# Altium project FMC_DAC_125M_14B_16CHA.PrjPCB (part 2 of 2)

## Sheet Clock_circuit.SchDoc: Shuttler
size 420 x 297 mm; Author: G.Kasprowicz; CompanyName: WUT ISE; DrawnBy: G.Kasprowicz; Organization: WUT ISE; Address1: PW ISE; Address2: Nowowiejska 15/19 00-665 Warsaw; Address3: gkasprow@gmail.com; DocumentNumber: 3; Revision: 1.2; SheetNumber: 3; SheetTotal: 10; ModifiedBy: -; CheckedDate: -; Title2: Clock distribution; DivGrp: WUT ISE; Designer: G.Kasprowicz; ModifiedDate: -; ProjectName: Sensor Box
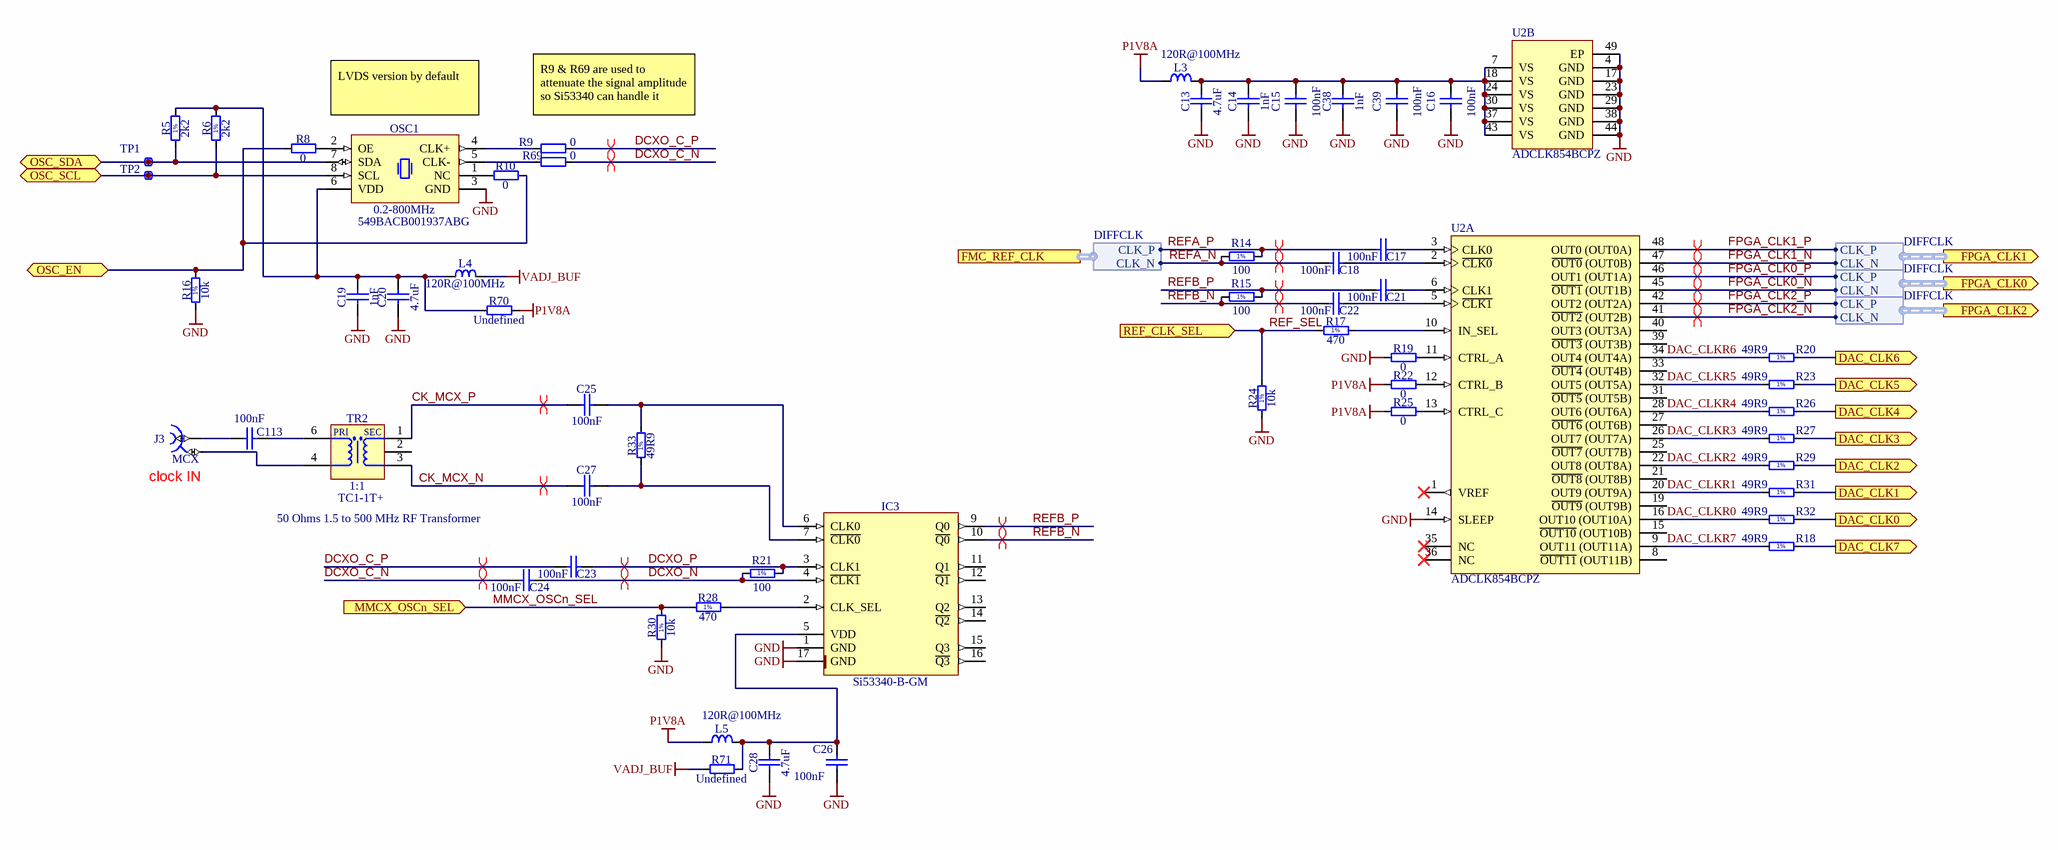
[diagram p3: Clock_circuit.SchDoc]

### Parts
C13  4.7uF  [CAPC2012X135N]
C14  1nF  [CAPC1005X55N]
C15  100nF  [CAPC1005X55N]
C16  100nF  [CAPC1005X55N]
C17  100nF  [CAPC1005X55N]
C18  100nF  [CAPC1005X55N]
C19  1nF  [CAPC1005X55N]
C20  4.7uF  [CAPC2012X135N]
C21  100nF  [CAPC1005X55N]
C22  100nF  [CAPC1005X55N]
C23  100nF  [CAPC1005X55N]
C24  100nF  [CAPC1005X55N]
C25  100nF  [CAPC1005X55N]
C26  100nF  [CAPC1005X55N]
C27  100nF  [CAPC1005X55N]
C28  4.7uF  [CAPC2012X135N]
C38  1nF  [CAPC1005X55N]
C39  100nF  [CAPC1005X55N]
C113  100nF  [CAPC0603X33N]
IC3  Si53340-B-GM  [QFN50P300X300X90-17N-S175]
J3  MCX  [AMPHENOL_919-383J-51A]
L3  120R@100MHz  [INDC1608X95N]
L4  120R@100MHz  [INDC1608X65N]
L5  120R@100MHz  [INDC1608X95N]
OSC1  0.2-800MHz  Manufacturer Part Number: 549BACB001937ABG  [OSC_SILICON-LAB_SI549-A]
R5  2k2  [RESC1005X40N]
R6  2k2  [RESC1005X40N]
R8  0  [RESC1005X40N]
R9  0  [RESC1005X40N]
R10  0  [RESC1005X40N]
R14  100  [RESC0603X28N]
R15  100  [RESC0603X28N]
R16  10k  [RESC1005X40N]
R17  470  [RESC1005X40N]
R18  49R9  [RESC1005X40N]
R19  0  [RESC1005X40N]
R20  49R9  [RESC1005X40N]
R21  100  [RESC0603X28N]
R22  0  [RESC1005X40N]
R23  49R9  [RESC1005X40N]
R24  10k  [RESC1005X40N]
R25  0  [RESC1005X40N]
R26  49R9  [RESC1005X40N]
R27  49R9  [RESC1005X40N]
R28  470  [RESC1005X40N]
R29  49R9  [RESC1005X40N]
R30  10k  [RESC1005X40N]
R31  49R9  [RESC1005X40N]
R32  49R9  [RESC1005X40N]
R33  49R9  [RESC1005X40N]
R69  0  [RESC1005X40N]
R70  Undefined  [RESC1608X55N]
R71  Undefined  [RESC1608X55N]
TP1  I2C SW SDA  [TPS127]  (value not drawn)  (no BOM)
TP2  I2C SW SCL  [TPS127]  (value not drawn)  (no BOM)
TR2  1:1  Part Description: 50 Ohms 1.5 to 500 MHz RF Transformer  Manufacturer Part Number: TC1-1T+  [XFMR_MINI-CIRCUITS_AT224-1]
U2  ADCLK854BCPZ  [ADI-CP-48-6_L]  (parts A,B of 2)

### Ports
DAC_CLK0 (out), DAC_CLK1 (out), DAC_CLK2 (out), DAC_CLK3 (out), DAC_CLK4 (out), DAC_CLK5 (out), DAC_CLK6 (out), DAC_CLK7 (out), FMC_REF_CLK (harness DIFFCLK), FPGA_CLK0 (out, harness DIFFCLK), FPGA_CLK1 (out, harness DIFFCLK), FPGA_CLK2 (out, harness DIFFCLK), MMCX_OSCn_SEL (in), OSC_EN (bidir), OSC_SCL (bidir), OSC_SDA (bidir), REF_CLK_SEL (in)

### Harnesses
DIFFCLK: CLK_P, CLK_N

### Nets
GND: C13.1 C14.1 C15.1 C16.1 C19.1 C20.1 C26.1 C28.1 C38.1 C39.1 IC3.1(GND) IC3.17(GND) OSC1.3(GND) R16.1 R19.1 R24.1 R30.1 U2.4(GND) U2.14(SLEEP) U2.17(GND) U2.23(GND) U2.29(GND) U2.38(GND) U2.44(GND) U2.49(EP)
P1V8A: L3.2 L5.2 R22.1 R25.1 R70.2
VADJ_BUF: L4.1 R71.1
CK_MCX_N: C27.1 TR2.3(S)
CK_MCX_P: C25.1 TR2.1(SDOT)
DAC_CLK0: R32.2 ; port DAC_CLK0
DAC_CLK1: R31.2 ; port DAC_CLK1
DAC_CLK2: R29.2 ; port DAC_CLK2
DAC_CLK3: R27.2 ; port DAC_CLK3
DAC_CLK4: R26.2 ; port DAC_CLK4
DAC_CLK5: R23.2 ; port DAC_CLK5
DAC_CLK6: R20.2 ; port DAC_CLK6
DAC_CLK7: R18.2 ; port DAC_CLK7
DAC_CLKR0: R32.1 U2.16(OUT10_(OUT10A))
DAC_CLKR1: R31.1 U2.20(OUT9_(OUT9A))
DAC_CLKR2: R29.1 U2.22(OUT8_(OUT8A))
DAC_CLKR3: R27.1 U2.26(OUT7_(OUT7A))
DAC_CLKR4: R26.1 U2.28(OUT6_(OUT6A))
DAC_CLKR5: R23.1 U2.32(OUT5_(OUT5A))
DAC_CLKR6: R20.1 U2.34(OUT4_(OUT4A))
DAC_CLKR7: R18.1 U2.9(OUT11_(OUT11A))
DCXO_C_N: C24.1 R69.2
DCXO_C_P: C23.1 R9.2
DCXO_N: C24.2 IC3.4(~{CLK1}) R21.1
DCXO_P: C23.2 IC3.3(CLK1) R21.2
FPGA_CLK0_N: U2.45(~{OUT1}_(OUT1B)) ; port FPGA_CLK0.CLK_N
FPGA_CLK0_P: U2.46(OUT1_(OUT1A)) ; port FPGA_CLK0.CLK_P
FPGA_CLK1_N: U2.47(~{OUT0}_(OUT0B)) ; port FPGA_CLK1.CLK_N
FPGA_CLK1_P: U2.48(OUT0_(OUT0A)) ; port FPGA_CLK1.CLK_P
FPGA_CLK2_N: U2.41(~{OUT2}_(OUT2B)) ; port FPGA_CLK2.CLK_N
FPGA_CLK2_P: U2.42(OUT2_(OUT2A)) ; port FPGA_CLK2.CLK_P
MMCX_OSCn_SEL: R28.1 R30.2 ; port MMCX_OSCn_SEL
REF_SEL: R17.1 R24.2 ; port REF_CLK_SEL
REFA_N: C18.1 R14.1 ; port FMC_REF_CLK.CLK_N
REFA_P: C17.1 R14.2 ; port FMC_REF_CLK.CLK_P
REFB_N: C22.1 IC3.10(~{Q0}) R15.1
REFB_P: C21.1 IC3.9(Q0) R15.2
NetC13_2: C13.2 C14.2 C15.2 C16.2 C38.2 C39.2 L3.1 U2.7(VS) U2.18(VS) U2.24(VS) U2.30(VS) U2.37(VS) U2.43(VS)
NetC17_2: C17.2 U2.3(CLK0)
NetC18_2: C18.2 U2.2(~{CLK0})
NetC19_2: C19.2 C20.2 L4.2 OSC1.6(VDD) R5.2 R6.2 R70.1
NetC21_2: C21.2 U2.6(CLK1)
NetC22_2: C22.2 U2.5(~{CLK1})
NetC25_2: C25.2 IC3.6(CLK0) R33.2
NetC26_2: C26.2 C28.2 IC3.5(VDD) L5.1 R71.2
NetC27_2: C27.2 IC3.7(~{CLK0}) R33.1
NetC113_1: C113.1 TR2.6(PDOT)
NetC113_2: C113.2 J3.1
NetIC3_2: IC3.2(CLK_SEL) R28.2
NetJ3_2: J3.2 TR2.4(P)
NetOSC1_1: OSC1.1(NC) R10.1
NetOSC1_2: OSC1.2(OE) R8.2
NetOSC1_4: OSC1.4(CLK+) R9.1
NetOSC1_5: OSC1.5(CLK-) R69.1
NetOSC1_7: OSC1.7(SDA) R5.1 TP1.1 ; port OSC_SDA
NetOSC1_8: OSC1.8(SCL) R6.1 TP2.1 ; port OSC_SCL
NetR8_1: R8.1 R10.2 R16.2 ; port OSC_EN
NetR17_2: R17.2 U2.10(IN_SEL)
NetR19_2: R19.2 U2.11(CTRL_A)
NetR22_2: R22.2 U2.12(CTRL_B)
NetR25_2: R25.2 U2.13(CTRL_C)

Not connected (* = marked no-connect by the designer): IC3 11(Q1) 12(~{Q1}) 13(Q2) 14(~{Q2}) 15(Q3) 16(~{Q3}); TR2 2(NU); U2 1(VREF)* 8(~{OUT11}_(OUT11B)) 15(~{OUT10}_(OUT10B)) 19(~{OUT9}_(OUT9B)) 21(~{OUT8}_(OUT8B)) 25(~{OUT7}_(OUT7B)) 27(~{OUT6}_(OUT6B)) 31(~{OUT5}_(OUT5B)) 33(~{OUT4}_(OUT4B)) 35(NC)* 36(NC)* 39(~{OUT3}_(OUT3B)) 40(OUT3_(OUT3A))

### Layout directives
differential pair: CK_MCX_N, CK_MCX_P, DCXO_C_N, DCXO_C_P, DCXO_N, DCXO_P, FPGA_CLK0_N, FPGA_CLK0_P, FPGA_CLK1_N, FPGA_CLK1_P, FPGA_CLK2_N, FPGA_CLK2_P, REFA_N, REFA_P, REFB_N, REFB_P
differential pair; differential pair class Diff_100Ohm: DCXO_C_N, DCXO_C_P

### Notes on the sheet
- LVDS version by default
- R9 & R69 are used to attenuate the signal amplitude so Si53340 can handle it
- (near J3) clock IN
- Project/Equipment
- Document
- Designer
- Drawn by
- Check.by
- Copyright WUT ISE 2018.
  This documentation describes Open Hardware and is licensed under the CERN OHL v.1.1. You may redistribute and modify this documentation under the terms of the CERN OHL v.1.1. (http://ohwr.org/CERNOHL). This documentation is distributed WITHOUT ANY EXPRESS OR IMPLIED WARRANTY, INCLUDING OF MERCHANTABILITY, SATISFACTORY QUALITY AND FITNESS FOR A PARTICULAR PURPOSE. Please see the CERN OHL v.1.1 for applicable conditions.
- Contact
- File
- Last Mod.
- Print Date
- Sheet
- Size
- A3
- of
- Rev
- (in symbol R0201_100R_1%_0.05W_200PPM) 1%
- (in symbol R0402_2K2_1%_0.0625W_100PPM) 1%
- (in symbol R0402_10K_1%_0.0625W_100PPM) 1%
- (in symbol R0402_49R9_1%_0.0625W_100PPM) 1%
- (in symbol R0402_470R_1%_0.0625W_100PPM) 1%
- (in symbol XFMR_MINI-CIRCUITS_TC1-1+) PRI; SEC

### Library data of the parts
C13 C20 C28 = CC0805_4.7UF_10V_10%_X5R: Non-polarised capacitor; Part Description: SMD Multilayer Chip Ceramic Capacitor; Manufacturer: GENERIC; Manufacturer1 Part Number: 222224013672; Voltage: 10V; TC: X5R; Tolerance: ±10%; Part Number: CC0805_4.7UF_10V_10%_X5R; Component Kind: Standard; Component Type: Standard; Pin Count: 2; Value: 4.7uF; Status: Preferred; Manufacturer Part Number: CC0805_4.7UF_10V_10%_X5R; Case: 0805; Mounted: Yes; Socket: No; SMD: Yes; Sense: No; Manufacturer1 Example: PHYCOMP; Manufacturer1 ComponentHeight: 1.45mm; HelpURL: \\cern.ch\dfs\Applications\Altium\Datasheets\CC0805_X5R_PHYCOMP_HC.pdf; Author: CERN DEM JLC; CreateDate: 03.12.2007; LatestRevisionDate: 03.12.2007
C14 C19 C38 = CC0402_1NF_50V_10%_X7R: Non-polarised capacitor; Part Description: SMD Multilayer Chip Ceramic Capacitor; Manufacturer: GENERIC; Manufacturer1 Part Number: 223858715623; Voltage: 50V; TC: X7R; Tolerance: ±10%; Part Number: CC0402_1NF_50V_10%_X7R; Component Kind: Standard; Component Type: Standard; Pin Count: 2; Value: 1nF; Status: Not Recommended; Manufacturer Part Number: CC0402_1NF_50V_10%_X7R; Case: 0402; Mounted: Yes; Socket: No; SMD: Yes; Sense: No; Manufacturer1 Example: PHYCOMP; Manufacturer1 ComponentHeight: 0.55mm; HelpURL: \\cern.ch\dfs\Applications\Altium\Datasheets\CC0402_X7R_PHYCOMP.pdf; Author: CERN DEM JLC; CreateDate: 03.12.2007; LatestRevisionDate: 03.12.2007
C15-C18 C21-C27 C39 = CC0402_100NF_16V_10%_X5R: Non-polarised capacitor; Part Description: SMD Multilayer Chip Ceramic Capacitor; Manufacturer: GENERIC; Manufacturer1 Part Number: GRM155R61C104KA88D; Voltage: 16V; TC: X5R; Tolerance: ±10%; Part Number: CC0402_100NF_16V_10%_X5R; Component Kind: Standard; Component Type: Standard; Pin Count: 2; Value: 100nF; Status: None; Manufacturer Part Number: CC0402_100NF_16V_10%_X5R; Case: 0402; Mounted: Yes; Socket: No; SMD: Yes; Sense: No; Manufacturer1 Example: MURATA; Manufacturer1 ComponentHeight: 0.55mm; HelpURL: \\cern.ch\dfs\Applications\Altium\Datasheets\CC0402_X5R_MURATA_GRM.pdf; Author: CERN DEM JLC; CreateDate: 10.12.2013; LatestRevisionDate: 10.12.2013
C113 = CC0201_100NF_6.3V_10%_X5R: Non-polarised capacitor; Part Description: SMD Multilayer Chip Ceramic Capacitor; Manufacturer: GENERIC; Manufacturer1 Part Number: 02016D104KAT2A; Voltage: 6.3V; TC: X5R; Tolerance: ±10%; Table: Capacitors SMD; Part Number: CC0201_100NF_6.3V_10%_X5R; Component Kind: Standard; Component Type: Standard; Pin Count: 2; Value: 100nF; Status: Not Recommended; Manufacturer Part Number: CC0201_100NF_6.3V_10%_X5R; Case: 0201; Mounted: Yes; Socket: No; SMD: Yes; Manufacturer1 Example: AVX; Manufacturer1 ComponentHeight: 0.33mm; HelpURL: \\cern.ch\dfs\Applications\Altium\Datasheets\CC0201_X5R_AVX.pdf; Author: CERN DEM JLC; CreateDate: 2007-12-03; LatestRevisionDate: 2007-12-03
IC3 = Si53340-B-GM: Low-Jitter LVDS Fanout Clock Buffers, 10-Output,  Any-Input, Any-Frequency up to 1250MHz; Manufacturer: SILICON LABS; PressFit: No; Bonding: No; Part Number: Si53340-B-GM; Component Kind: Standard; Component Type: Standard; Device: Si53340-B-GM; PackageDescription: QFN, 0.50mm Pitch, Square; 16 Pin, 3.00mm L X 3.00mm W X 0.90mm H Body (w/thermal tab 1.75mm x 1.75mm), IPC Medium Density; Part Description: Low-Jitter LVDS Fanout Clock Buffers, 10-Output,  Any-Input, Any-Frequency up to 1250MHz; Manufacturer Part Number: Si53340-B-GM; Pin Count: 17; Case: QFN16; Mounted: Yes; Socket: No; SMD: Yes; Sense: No; ComponentHeight: 0.9mm; HelpURL: \\cern.ch\dfs\Applications\Altium\Datasheets\Si53340-B-GM.pdf; Author: CERN DEM MR; CreateDate: 04.09.2017; LatestRevisionDate: 04.09.2017
J3 = AMPHENOL_919-383J-51A: Part Description: 50 Ohm, RF Connector, MCX Right Angle PCB Receptacle Jack; PressFit: No; Part Number: AMPHENOL_919-383J-51A; Component Kind: Standard; Component Type: Standard; Pin Count: 5; Family: MCX; Mounted: Yes; Socket: No; SMD: No; Sense: No; Status: None; Manufacturer: AMPHENOL; Manufacturer Part Number: 919-383J-51A; ComponentHeight: 6mm; HelpURL: \\cern.ch\dfs\Applications\Altium\Datasheets\AMPHENOL_919-383J-51A.pdf; Author: CERN DEM BC; CreateDate: 31/01/2019; LatestRevisionDate: 31/01/2019
L3 L5 = IND0603_MURATA_BLM18PG121SN1D: Inductor; Part Description: SMD EMIFIL Chip Ferrite Bead; Manufacturer: MURATA; Power: 2A; Resistance: 0.05R; Part Number: IND0603_MURATA_BLM18PG121SN1D; Component Kind: Standard; Component Type: Standard; Pin Count: 2; Value: 120R@100MHz; Status: None; Manufacturer Part Number: BLM18PG121SN1D; Case: 0603; Mounted: Yes; Socket: No; SMD: Yes; Sense: No; ComponentHeight: 0.95mm; HelpURL: \\cern.ch\dfs\Applications\Altium\Datasheets\IND0603_MURATA_BLM18P.pdf; Author: CERN DEM BC; CreateDate: 2015-07-27; LatestRevisionDate: 2015-07-27
L4 = IND0603_MURATA_BLM18SG121TN1D: Inductor; Part Description: SMD EMIFIL Suppression Chip Ferrite Bead; Manufacturer: MURATA; Power: 3A; Resistance: 0.025R; Tolerance: ±25%; Part Number: IND0603_MURATA_BLM18SG121TN1D; Component Kind: Standard; Component Type: Standard; Pin Count: 2; Value: 120R@100MHz; Status: None; Manufacturer Part Number: BLM18SG121TN1D; Case: 0603; Mounted: Yes; Socket: No; SMD: Yes; Sense: No; ComponentHeight: 0.65mm; HelpURL: \\cern.ch\dfs\Applications\Altium\Datasheets\IND0603_MURATA_BLM18S.pdf; Author: CERN DEM JLC; CreateDate: 23.07.2014; LatestRevisionDate: 23.07.2014
OSC1 = OSC_0.2-800MHZ_SILICON-LAB_549BACB001937ABG: Ultra Low Jitter I2C Programmable Crystal Oscillator (XO), Si549 Series; Part Description: 0.2-800MHz, 1.8V/2.5V/3.3V ±20ppm LVDS, Ultra Low Jitter I2C Programmable Crystal Oscillator (XO), Si549 Series; Manufacturer: SILICON LABS; PressFit: No; Bonding: No; Part Number: OSC_0.2-800MHZ_SILICON-LAB_549BACB001937ABG; Component Kind: Standard; Component Type: Standard; PackageDescription: Oscillator Si549 Series, 8 pins, 5x7mm; Value: 0.2-800MHz; Pin Count: 8; Mounted: Yes; Socket: No; SMD: Yes; Sense: No; ComponentHeight: 1.33mm; HelpURL: \\cern.ch\dfs\Applications\Altium\Datasheets\OSC_SILICON-LAB_SI549.pdf; Author: CERN DEM JMW; CreateDate: 27/11/2019; LatestRevisionDate: 02/12/2019
R5 R6 = R0402_2K2_1%_0.0625W_100PPM: Resistor - 1%; Part Description: General Purpose Thick Film Chip Resistor; Manufacturer: GENERIC; Manufacturer1 Part Number: 232270672202L; TC: ±100ppm/°C; PressFit: No; Part Number: R0402_2K2_1%_0.0625W_100PPM; Component Kind: Standard; Component Type: Standard; Pin Count: 2; Value: 2k2; Status: Not Recommended; Power: 0.0625W; Tolerance: ±1%; Manufacturer Part Number: R0402_2K2_1%_0.0625W_100PPM; Case: 0402; Mounted: Yes; Sense: No; Socket: No; SMD: Yes; Manufacturer1 Example: YAGEO PHYCOMP; Manufacturer1 ComponentHeight: 0.4mm; HelpURL: \\cern.ch\dfs\Applications\Altium\Datasheets\R0402_Phycomp_RC0402.pdf; Author: CERN DEM JLC; CreateDate: 03.12.2007; LatestRevisionDate: 17.10.2012
R8-R10 R19 R22 R25 R69 = R0402_0R_JUMPER: Resistor; Part Description: 1A (0.05R Max DC Resistance) Zero Ohm Jumper; Manufacturer: GENERIC; Manufacturer1 Part Number: 232270591001L; PressFit: No; Part Number: R0402_0R_JUMPER; Component Kind: Standard; Component Type: Standard; Pin Count: 2; Value: 0; Status: Not Recommended; Manufacturer Part Number: R0402_0R_JUMPER; Case: 0402; Mounted: Yes; Sense: No; Socket: No; SMD: Yes; Manufacturer1 Example: YAGEO PHYCOMP; Manufacturer1 ComponentHeight: 0.4mm; HelpURL: \\cern.ch\dfs\Applications\Altium\Datasheets\R0402_Phycomp_RC0402.pdf; Author: CERN DEM JLC; CreateDate: 03.12.2007; LatestRevisionDate: 17.10.2012
R14 R15 R21 = R0201_100R_1%_0.05W_200PPM: Resistor - 1%; Part Description: Thick Film Chip Resistor; Manufacturer: GENERIC; Manufacturer1 Part Number: CRCW0201100RFNED; Power: 0.05W; TC: ±200ppm/°C; PressFit: No; Part Number: R0201_100R_1%_0.05W_200PPM; Component Kind: Standard; Component Type: Standard; Pin Count: 2; Value: 100; Status: Not Recommended; Tolerance: ±1%; Manufacturer Part Number: R0201_100R_1%_0.05W_200PPM; Case: 0201; Mounted: Yes; Socket: No; SMD: Yes; Manufacturer1 Example: VISHAY; Manufacturer1 ComponentHeight: 0.27mm; HelpURL: \\cern.ch\dfs\Applications\Altium\Datasheets\R0201_VISHAY_CRCW0201 e3.pdf; Author: CERN DEM JLC; CreateDate: 13.11.2014; LatestRevisionDate: 13.11.2014; Sense: No
R16 R24 R30 = R0402_10K_1%_0.0625W_100PPM: Resistor - 1%; Part Description: General Purpose Thick Film Chip Resistor; Manufacturer: GENERIC; Manufacturer1 Part Number: 232270671003L; TC: ±100ppm/°C; Table: Resistors SMD; Part Number: R0402_10K_1%_0.0625W_100PPM; Component Kind: Standard; Component Type: Standard; Pin Count: 2; Value: 10k; Status: Not recommended; Power: 0.0625W; Tolerance: ±1%; Manufacturer Part Number: R0402_10K_1%_0.0625W_100PPM; Case: 0402; Mounted: Yes; Socket: No; SMD: Yes; Manufacturer1 Example: YAGEO PHYCOMP; Manufacturer1 ComponentHeight: 0.4mm; HelpURL: \\cern.ch\dfs\Applications\Altium\Datasheets\R0402_Phycomp_RC0402.pdf; Author: CERN DEM JLC; CreateDate: 3/12/2007; LatestRevisionDate: 17/10/2012
R17 R28 = R0402_470R_1%_0.0625W_100PPM: Resistor - 1%; Part Description: General Purpose Thick Film Chip Resistor; Manufacturer: GENERIC; Manufacturer1 Part Number: 232270674701L; TC: ±100ppm/°C; PressFit: No; Part Number: R0402_470R_1%_0.0625W_100PPM; Component Kind: Standard; Component Type: Standard; Pin Count: 2; Value: 470; Status: Not Recommended; Power: 0.0625W; Tolerance: ±1%; Manufacturer Part Number: R0402_470R_1%_0.0625W_100PPM; Case: 0402; Mounted: Yes; Sense: No; Socket: No; SMD: Yes; Manufacturer1 Example: YAGEO PHYCOMP; Manufacturer1 ComponentHeight: 0.4mm; HelpURL: \\cern.ch\dfs\Applications\Altium\Datasheets\R0402_Phycomp_RC0402.pdf; Author: CERN DEM JLC; CreateDate: 03.12.2007; LatestRevisionDate: 17.10.2012
R18 R20 R23 R26 R27 R29 R31-R33 = R0402_49R9_1%_0.0625W_100PPM: Resistor - 1%; Part Description: General Purpose Thick Film Chip Resistor; Manufacturer: GENERIC; Manufacturer1 Part Number: 232270674999L or RC0402FR-0749R9L; TC: ±100ppm/°C; PressFit: No; Part Number: R0402_49R9_1%_0.0625W_100PPM; Component Kind: Standard; Component Type: Standard; Pin Count: 2; Value: 49R9; Status: Not Recommended; Power: 0.0625W; Tolerance: ±1%; Manufacturer Part Number: R0402_49R9_1%_0.0625W_100PPM; Case: 0402; Mounted: Yes; Sense: No; Socket: No; SMD: Yes; Manufacturer1 Example: YAGEO PHYCOMP; Manufacturer1 ComponentHeight: 0.4mm; HelpURL: \\cern.ch\dfs\Applications\Altium\Datasheets\R0402_Phycomp_RC0402.pdf; Author: CERN DEM JLC; CreateDate: 24.10.2012; LatestRevisionDate: 24.10.2012
R70 R71 = R0603_NO-VALUE: Resistor; Part Description: Reserved Footprint For a 0603 (1608) Chip Resistor; PressFit: No; Mounted: No; Part Number: R0603_NO-VALUE; Component Kind: Standard; Component Type: Standard; Pin Count: 2; Value: Undefined; Status: None; Manufacturer: Undefined; Manufacturer Part Number: R0603_NO-VALUE; Case: 0603; Sense: No; Socket: No; SMD: Yes; Manufacturer1 Example: Undefined; Manufacturer1 Part Number: Undefined; Manufacturer1 ComponentHeight: Undefined; HelpURL: Undefined; Author: CERN DEM JLC; CreateDate: 03.12.2007; LatestRevisionDate: 13.03.2008
TP1 TP2 = SMD_PAD_1.27X1.27MM: Test Point; Part Description: 1.27mm x 1.27mm PCB Copper Area (SMD Test Point); Mounted: No; Part Number: SMD_PAD_1.27X1.27MM; Component Type: Standard (No BOM); Pin Count: 1; Family: Test Point; Socket: No; SMD: Yes; Sense: No; Status: None; ComponentHeight: 0mm; HelpURL: Undefined; Author: CERN DEM JLC; CreateDate: 12.01.2008; LatestRevisionDate: 12.01.2008; PackageDescription: 1.27mm x 1.27mm PCB Copper Area (SMD Test Point)
TR2 = XFMR_MINI-CIRCUITS_TC1-1+: 50 Ohm  0.4 To 500MHz RF Transformers; Part Number: XFMR_MINI-CIRCUITS_TC1-1T+; Component Kind: Standard; Component Type: Standard; Pin Count: 5; Value: 1:1; Status: None; Manufacturer: MINI-CIRCUITS; Mounted: Yes; Socket: No; SMD: Yes; ComponentHeight: 4.06mm; HelpURL: \\cern.ch\dfs\Applications\Altium\Datasheets\XFMR_MINI-CIRCUITS_TC1-1+.pdf; Author: CERN DEM JLC; CreateDate: 2010-02-08; LatestRevisionDate: 2010-04-27; Table: Transformers
U2 = CMP-0884-00053-1: 12 LVDS / 24 CMOS Outputs, Low Power Clock Fanout Buffer, 1.8 V Supply, Industrial, 48-pin QFN (CP-48-6), Tray; Manufacturer: Analog Devices; On-Chip VCO or DCO: No; Supply Voltage (V): 1.8; # of Outputs: 24; Output Logic: CMOS, LVDS; # of Inputs: 2; Max f-out: 1.2 GHz; I/O Interface: Pin Select; Mounting Technology: Surface Mount; Code_JEDEC: MO-220-VKKD-2; ComponentLink4Description: Product URL; ComponentLink3URL: http:/www.analog.com/static/imported-files/packages/PKG_PDF/LFCSP(CP)/CP_48_6.pdf; DatasheetVersion: Rev. 0; ComponentLink3Description: Package Specification; ComponentLink4URL: http://www.analog.com/en/clock-and-timing/clock-generation-and-distribution/adclk854/products/product.html; ComponentLink2URL: http://www.analog.com/static/imported-files/data_sheets/ADCLK854.pdf; PackageReference: CP-48-6; ComponentLink5URL: http://www.analog.com/en/clock-and-timing/clock-generation-and-distribution/adclk854/products/product.html#product-recommendations; ComponentLink2Description: Datasheet; PackageVersion: 080508-A, 08/2008; ComponentLink5Description: Reference Circuit; ComponentLink1Description: Manufacturer URL; Packing: Tray; PackageDescription: 48-Pin Lead Frame Chip Scale Package, Body 7 x 7 mm, Pitch 0.5 mm; PartNumber: ADCLK854BCPZ; ComponentLink1URL: http://www.analog.com/en/index.html

## Sheet References.SchDoc: Shuttler
size 420 x 297 mm; Author: G.Kasprowicz; CompanyName: WUT ISE; DrawnBy: G.Kasprowicz; Organization: WUT ISE; Address1: PW ISE; Address2: Nowowiejska 15/19 00-665 Warsaw; Address3: gkasprow@gmail.com; DocumentNumber: 9; Revision: 1.2; SheetNumber: 9; SheetTotal: 10; ModifiedBy: -; CheckedDate: -; Title2: References; DivGrp: WUT ISE; Designer: G.Kasprowicz; ModifiedDate: -; ProjectName: Sensor Box
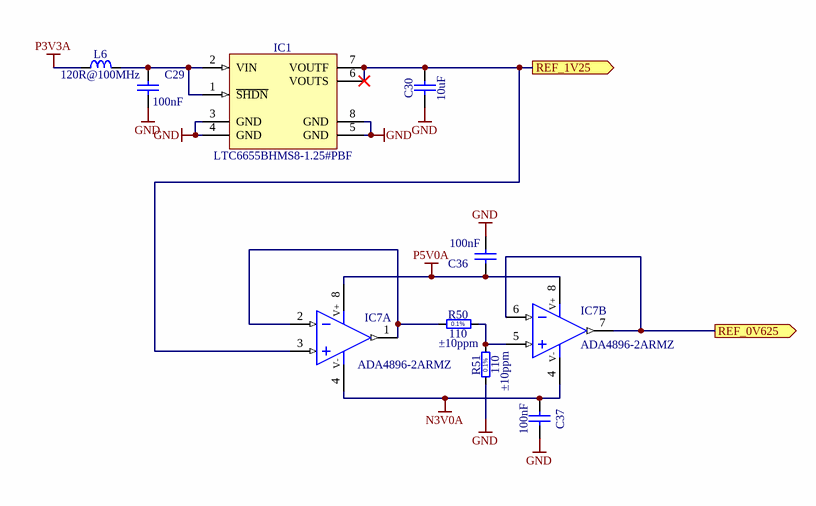
[diagram p4: References.SchDoc]

### Parts
C29  100nF  [CAPC1005X55N]
C30  10uF  [CAPC1608X80N]
C36  100nF  [CAPC0603X33N]
C37  100nF  [CAPC0603X33N]
IC1  LTC6655BHMS8-1.25#PBF  [SOP65P490X110-8N]
IC7  ADA4896-2ARMZ  [SOP65P490X110-8N]  (parts A,B of 2)
L6  120R@100MHz  [INDC1608X65N]
R50  110  TC: ±10ppm  [RESC1608X55N]
R51  110  TC: ±10ppm  [RESC1608X55N]

### Ports
REF_0V625 (out), REF_1V25 (out)

### Nets
GND: C29.2 C30.1 C36.1 C37.1 IC1.3(GND) IC1.4(GND) IC1.5(GND) IC1.8(GND) R51.1
N3V0A: C37.2 IC7.4(V-)
P3V3A: L6.2
P5V0A: C36.2 IC7.8(V+)
AFE_REF: IC7.6(IN-) IC7.7(OUT) ; port REF_0V625
DAC_REF: C30.2 IC1.6(VOUTS) IC1.7(VOUTF) IC7.3(IN+) ; port REF_1V25
NetC29_1: C29.1 IC1.1(~{SHDN}) IC1.2(VIN) L6.1
NetIC7_1: IC7.1(OUT) IC7.2(IN-) R50.1
NetIC7_5: IC7.5(IN+) R50.2 R51.2

### Notes on the sheet
- Project/Equipment
- Document
- Designer
- Drawn by
- Check.by
- Copyright WUT ISE 2020.
  This documentation describes Open Hardware and is licensed under the CERN OHL v.1.2. You may redistribute and modify this documentation under the terms of the CERN OHL v.1.2. (http://ohwr.org/CERNOHL). This documentation is distributed WITHOUT ANY EXPRESS OR IMPLIED WARRANTY, INCLUDING OF MERCHANTABILITY, SATISFACTORY QUALITY AND FITNESS FOR A PARTICULAR PURPOSE. Please see the CERN OHL v.1.2 for applicable conditions.
- Contact
- File
- Last Mod.
- Print Date
- Sheet
- Size
- A3
- of
- Rev
- (in symbol R0603_110R_0.1%_0.063W_10PPM) 0.1%

### Library data of the parts
C29 = CC0402_100NF_16V_10%_X7R: Non-polarised capacitor; Part Description: SMD Multilayer Chip Ceramic Capacitor; Manufacturer: GENERIC; Manufacturer1 Part Number: GRM155R71C104KA88D; Voltage: 16V; TC: X7R; Tolerance: ±10%; Table: Capacitors SMD; Part Number: CC0402_100NF_16V_10%_X7R; Component Kind: Standard; Component Type: Standard; Pin Count: 2; Value: 100nF; Status: Not Recommended; Manufacturer Part Number: CC0402_100NF_16V_10%_X7R; Case: 0402; Mounted: Yes; Socket: No; SMD: Yes; Manufacturer1 Example: MURATA; Manufacturer1 ComponentHeight: 0.55mm; HelpURL: \\cern.ch\dfs\Applications\Altium\Datasheets\CC0402_X7R_MURATA_GRM.pdf; Author: CERN DEM JLC; CreateDate: 2013-12-05; LatestRevisionDate: 2007-12-03
C30 = CC0603_10UF_16V_20%_X5R: Non-polarised capacitor; Part Description: SMD Multilayer Chip Ceramic Capacitor; Manufacturer: GENERIC; Manufacturer1 Part Number: GRM188R61C106MA73D; Voltage: 16V; TC: X5R; Tolerance: ±20%; Part Number: CC0603_10UF_16V_20%_X5R; Component Kind: Standard; Component Type: Standard; Pin Count: 2; Value: 10uF; Status: None; Manufacturer Part Number: CC0603_10UF_16V_20%_X5R; Case: 0603; Mounted: Yes; Socket: No; SMD: Yes; Sense: No; Manufacturer1 Example: MURATA; Manufacturer1 ComponentHeight: 0.8mm; HelpURL: \\cern.ch\dfs\Applications\Altium\Datasheets\CC0603_X5R_MURATA_GRM.pdf; Author: CERN DEM MR; CreateDate: 02/03/2016; LatestRevisionDate: 02/03/2016
C36 C37 = CC0201_100NF_6.3V_10%_X5R: Non-polarised capacitor; Part Description: SMD Multilayer Chip Ceramic Capacitor; Manufacturer: GENERIC; Manufacturer1 Part Number: 02016D104KAT2A; Voltage: 6.3V; TC: X5R; Tolerance: ±10%; Part Number: CC0201_100NF_6.3V_10%_X5R; Component Kind: Standard; Component Type: Standard; Pin Count: 2; Value: 100nF; Status: Not Recommended; Manufacturer Part Number: CC0201_100NF_6.3V_10%_X5R; Case: 0201; Mounted: Yes; Socket: No; SMD: Yes; Sense: No; Manufacturer1 Example: AVX; Manufacturer1 ComponentHeight: 0.33mm; HelpURL: \\cern.ch\dfs\Applications\Altium\Datasheets\CC0201_X5R_AVX.pdf; Author: CERN DEM JLC; CreateDate: 03.12.2007; LatestRevisionDate: 03.12.2007
IC1 = LTC6655BHMS8-1.25#PBF: 0.25ppm Noise, Low Drift Precision Buffered Voltage Reference; Part Description: 1.25V, 0.25ppm Noise, Low Drift Precision Buffered Voltage Reference; Manufacturer: LINEAR TECHNOLOGY; PressFit: No; Bonding: No; Part Number: LTC6655BHMS8-1.25#PBF; Component Kind: Standard; Component Type: Standard; Device: LTC6655BHMS8-1.25#PBF; PackageDescription: SOP, 8-Leads, Body 3.1x3.1mm (max), Pitch 0.65mm, IPC Medium Density; Manufacturer Part Number: LTC6655BHMS8-1.25#PBF; Pin Count: 8; Case: SSOP8; Mounted: Yes; Socket: No; SMD: Yes; Sense: No; ComponentHeight: 1.1mm; HelpURL: \\cern.ch\dfs\Applications\Altium\Datasheets\LTC6655BHMS8-1.25#PBF.pdf; Author: CERN DEM JLC; CreateDate: 22/11/2016; LatestRevisionDate: 22/11/2016
IC7 = ADA4896-2ARMZ: Dual Operational Amplifier; Part Description: 1 nV/sqrt Hz, Low Power, Rail-to-Rail Output Amplifiers; Manufacturer: ANALOG DEVICES; PressFit: No; Bonding: No; Part Number: ADA4896-2ARMZ; Component Kind: Standard; Component Type: Standard; Device: ADA4896-2ARMZ; PackageDescription: SOP, 0.65mm Pitch; 8 Pin, 3.00mm W X 3.00mm L X 1.10mm H body, IPC Medium Density; Manufacturer Part Number: ADA4896-2ARMZ; Pin Count: 8; Case: MSOP8; Mounted: Yes; Socket: No; SMD: Yes; Sense: No; ComponentHeight: 1.1mm; Author: CERN DEM MR; HelpURL: \\cern.ch\dfs\Applications\Altium\Datasheets\ADA4896-2ARMZ.pdf; CreateDate: 27/04/2016; LatestRevisionDate: 08/11/2017
L6 = IND0603_MURATA_BLM18SG121TN1D: as L4 on sheet Clock_circuit; Part Number: IND0603_MURATA_BLM18SG121TN1D; Component Kind: Standard; Component Type: Standard; Pin Count: 2; Value: 120R@100MHz; Status: None; Manufacturer Part Number: BLM18SG121TN1D; Case: 0603; Mounted: Yes; Socket: No; SMD: Yes; Sense: No; ComponentHeight: 0.65mm; HelpURL: \\cern.ch\dfs\Applications\Altium\Datasheets\IND0603_MURATA_BLM18S.pdf; Author: CERN DEM JLC; CreateDate: 23.07.2014; LatestRevisionDate: 23.07.2014
R50 R51 = R0603_110R_0.1%_0.063W_10PPM: Resistor - 0.1%; Part Description: Thin Film Chip Resistor; Manufacturer: GENERIC; Manufacturer1 Part Number: RN73C1J110RBTDF; Power: 0.063W; PressFit: No; Part Number: R0603_110R_0.1%_0.063W_10PPM; Component Kind: Standard; Component Type: Standard; Pin Count: 2; Value: 110; Status: Not Recommended; Tolerance: ±0.1%; Manufacturer Part Number: R0603_110R_0.1%_0.063W_10PPM; Case: 0603; Mounted: Yes; Sense: No; Socket: No; SMD: Yes; Manufacturer1 Example: TYCO HOLSWORTHY; Manufacturer1 ComponentHeight: 0.5mm; HelpURL: \\cern.ch\dfs\Applications\Altium\Datasheets\R0603_Tyco_RN73.pdf; Author: CERN DEM JLC; CreateDate: 03/12/2007; LatestRevisionDate: 13/03/2008

## Nets that join several sheets
GND: FMC_DAC_125M_14B_16CHA (7 pins), EEPROM_Temp (14 pins), U_DACs0 (15 pins), U_DACs1 (15 pins), U_DACs2 (15 pins), U_DACs3 (15 pins), U_DACs4 (15 pins), U_DACs5 (15 pins), U_DACs6 (15 pins), U_DACs7 (15 pins), Clock_circuit (25 pins), References (9 pins)
P3V3: FMC_DAC_125M_14B_16CHA (LD1.2 LD1.4 LD2.2 LD2.4), U_DACs0 (15 pins), U_DACs1 (15 pins), U_DACs2 (15 pins), U_DACs3 (15 pins), U_DACs4 (15 pins), U_DACs5 (15 pins), U_DACs6 (15 pins), U_DACs7 (15 pins)

## Assembly variants
default: not fitted R12 R12 R13 R55 R56 R68A R68B R68C R68D R68E R68F R68G R68H R70 R71